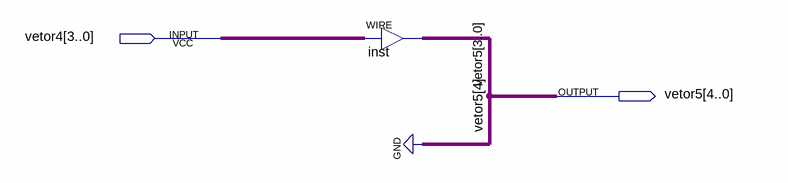
[diagram p0: schematic sheet]
// Quartus schematic TransformaVetorDe4Para5Bits.bdf as structural Verilog: 1 symbols, 2 pins
module TransformaVetorDe4Para5Bits (
  input  [3:0] vetor4,
  output [4:0] vetor5
);

  assign vetor5[3:0] = vetor4;  // WIRE inst

  assign vetor5[4] = 1'b0;
endmodule
